# EAGLE schematic master before (EAGLE 8.4.0)
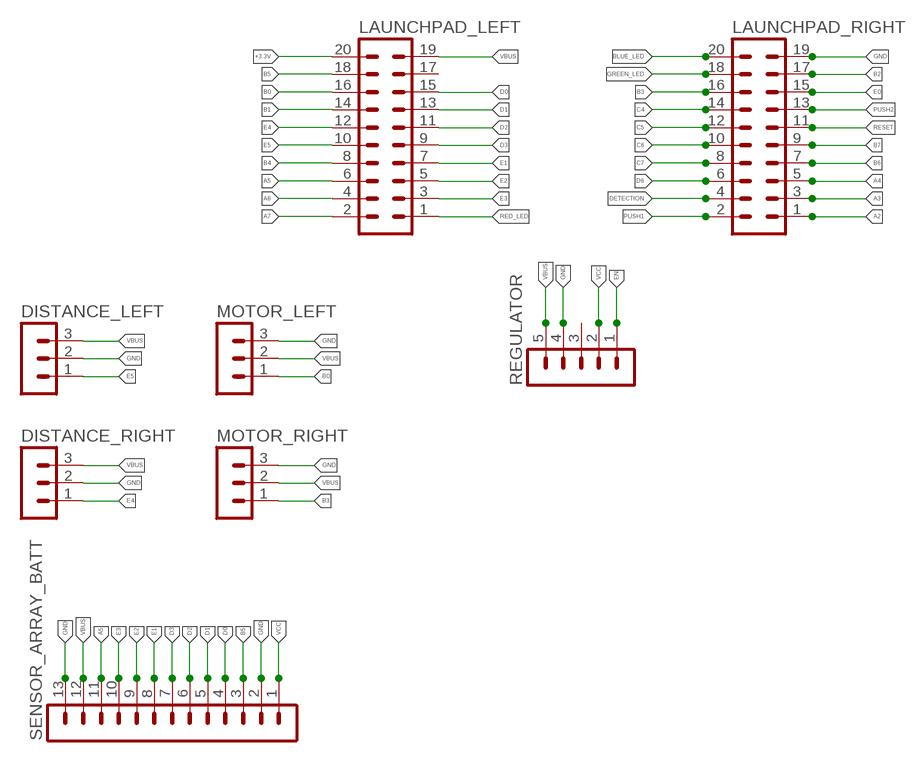
[diagram p0: schematic, sheet 1]

## Parts
DISTANCE_LEFT  MA03-1  [MA03-1]
DISTANCE_RIGHT  MA03-1  [MA03-1]
LAUNCHPAD_LEFT  MA10-2  [MA10-2]
LAUNCHPAD_RIGHT  MA10-2  [MA10-2]
MOTOR_LEFT  MA03-1  [MA03-1]
MOTOR_RIGHT  MA03-1  [MA03-1]
REGULATOR  MA05-1  [MA05-1]
SENSOR_ARRAY_BATT  MA13-1  [MA13-1]

## Nets
+3.3V: LAUNCHPAD_LEFT.20
A2: LAUNCHPAD_RIGHT.1
A3: LAUNCHPAD_RIGHT.3
A4: LAUNCHPAD_RIGHT.5
A5: LAUNCHPAD_LEFT.6 SENSOR_ARRAY_BATT.11
A6: LAUNCHPAD_LEFT.4
A7: LAUNCHPAD_LEFT.2
B0: LAUNCHPAD_LEFT.16 MOTOR_LEFT.1
B1: LAUNCHPAD_LEFT.14
B2: LAUNCHPAD_RIGHT.17
B3: LAUNCHPAD_RIGHT.16 MOTOR_RIGHT.1
B4: LAUNCHPAD_LEFT.8
B5: LAUNCHPAD_LEFT.18 SENSOR_ARRAY_BATT.3
B6: LAUNCHPAD_RIGHT.7
B7: LAUNCHPAD_RIGHT.9
BLUE_LED: LAUNCHPAD_RIGHT.20
C4: LAUNCHPAD_RIGHT.14
C5: LAUNCHPAD_RIGHT.12
C6: LAUNCHPAD_RIGHT.10
C7: LAUNCHPAD_RIGHT.8
D0: LAUNCHPAD_LEFT.15 SENSOR_ARRAY_BATT.4
D1: LAUNCHPAD_LEFT.13 SENSOR_ARRAY_BATT.5
D2: LAUNCHPAD_LEFT.11 SENSOR_ARRAY_BATT.6
D3: LAUNCHPAD_LEFT.9 SENSOR_ARRAY_BATT.7
D6: LAUNCHPAD_RIGHT.6
DETECTION: LAUNCHPAD_RIGHT.4
E0: LAUNCHPAD_RIGHT.15
E1: LAUNCHPAD_LEFT.7 SENSOR_ARRAY_BATT.8
E2: LAUNCHPAD_LEFT.5 SENSOR_ARRAY_BATT.9
E3: LAUNCHPAD_LEFT.3 SENSOR_ARRAY_BATT.10
E4: DISTANCE_RIGHT.1 LAUNCHPAD_LEFT.12
E5: DISTANCE_LEFT.1 LAUNCHPAD_LEFT.10
EN: REGULATOR.1
GND: DISTANCE_LEFT.2 DISTANCE_RIGHT.2 LAUNCHPAD_RIGHT.19 MOTOR_LEFT.3 MOTOR_RIGHT.3 REGULATOR.4 SENSOR_ARRAY_BATT.2 SENSOR_ARRAY_BATT.13
GREEN_LED: LAUNCHPAD_RIGHT.18
PUSH1: LAUNCHPAD_RIGHT.2
PUSH2: LAUNCHPAD_RIGHT.13
RED_LED: LAUNCHPAD_LEFT.1
RESET: LAUNCHPAD_RIGHT.11
VBUS: DISTANCE_LEFT.3 DISTANCE_RIGHT.3 LAUNCHPAD_LEFT.19 MOTOR_LEFT.2 MOTOR_RIGHT.2 REGULATOR.5 SENSOR_ARRAY_BATT.12
VCC: REGULATOR.2 SENSOR_ARRAY_BATT.1
Unconnected: LAUNCHPAD_LEFT.17 REGULATOR.3

## Library data of the parts
DISTANCE_LEFT DISTANCE_RIGHT MOTOR_LEFT MOTOR_RIGHT = con-lstb:MA03-1: PIN HEADER; OC_FARNELL: unknown; OC_NEWARK: unknown
LAUNCHPAD_LEFT LAUNCHPAD_RIGHT = con-lstb:MA10-2: PIN HEADER; OC_FARNELL: unknown; OC_NEWARK: unknown
REGULATOR = con-lstb:MA05-1: PIN HEADER; OC_FARNELL: unknown; OC_NEWARK: unknown
SENSOR_ARRAY_BATT = con-lstb:MA13-1: PIN HEADER; OC_FARNELL: unknown; OC_NEWARK: unknown; SPICEPREFIX: X